# Altium schematic sheet MCU.SchDoc
size A4; SheetNumber: 1; SheetTotal: 1
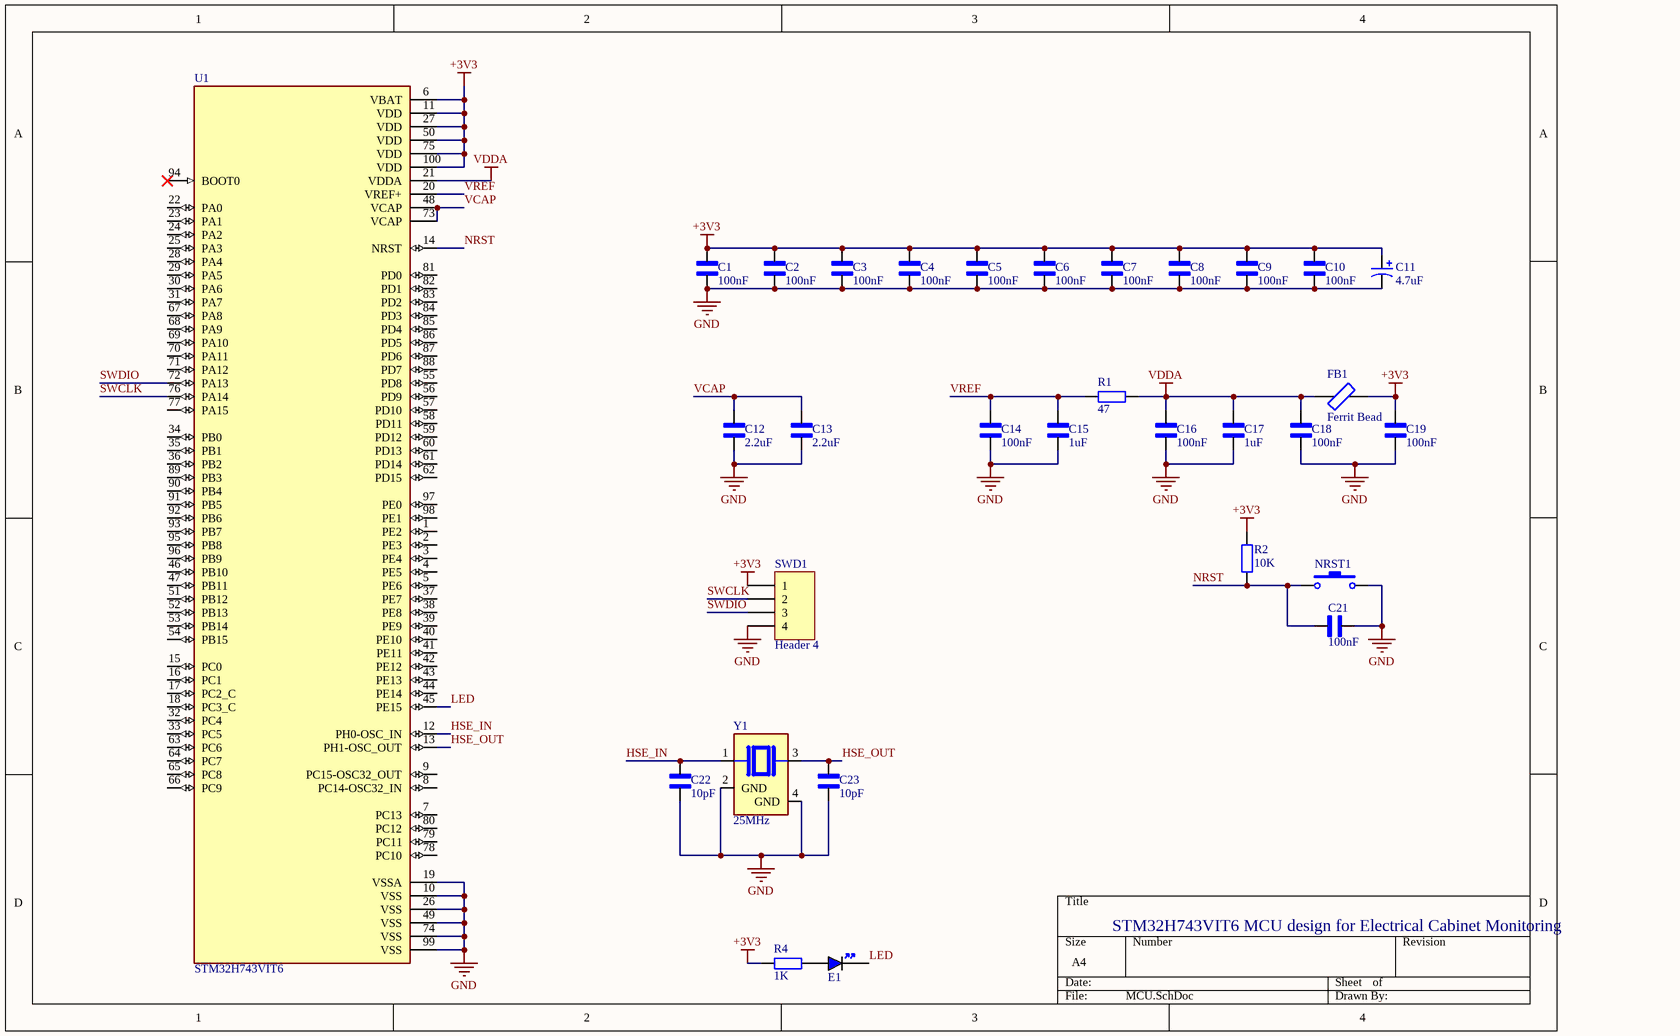
[diagram p0: MCU.SchDoc]

## Parts
C1  100nF  [CAPC2012X145N]
C2  100nF  [CAPC2012X145N]
C3  100nF  [CAPC2012X145N]
C4  100nF  [CAPC2012X145N]
C5  100nF  [CAPC2012X145N]
C6  100nF  [CAPC2012X145N]
C7  100nF  [CAPC2012X145N]
C8  100nF  [CAPC2012X145N]
C9  100nF  [CAPC2012X145N]
C10  100nF  [CAPC2012X145N]
C11  4.7uF  [CAPC2012X145N]
C12  2.2uF  [CAPC2012X145N]
C13  2.2uF  [CAPC2012X145N]
C14  100nF  [CAPC2012X145N]
C15  1uF  [CAPC2012X145N]
C16  100nF  [CAPC2012X145N]
C17  1uF  [CAPC2012X145N]
C18  100nF  [CAPC2012X145N]
C19  100nF  [CAPC2012X145N]
C21  100nF  [CAPC2012X145N]
C22  10pF  [CAPC2012X145N]
C23  10pF  [CAPC2012X145N]
E1  BLUE  [LED_0805_BLUE]  (value not drawn)
FB1  Ferrit Bead  [RES-SMD-0805]
NRST1  SW-SMD  [SW-SMD]  (value not drawn)
R1  47  [SM-0805]
R2  10K  [SM-0805]
R4  1K  [SM-0805]
SWD1  Header 4  [HDR1X4]
U1  STM32H743VIT6  [QFP50P1600X1600X160-100N]
Y1  25MHz  [XTAL_ABM8G-25.000MHZ-B4Y-T]

## Nets
+3V3: C1.2 C2.2 C3.2 C4.2 C5.2 C6.2 C7.2 C8.2 C9.2 C10.2 C11.2 C19.2 FB1.2 R2.2 R4.1 SWD1.1 U1.6(VBAT) U1.11(VDD) U1.27(VDD) U1.50(VDD) U1.75(VDD) U1.100(VDD)
GND: C1.1 C2.1 C3.1 C4.1 C5.1 C6.1 C7.1 C8.1 C9.1 C10.1 C11.1 C12.1 C13.1 C14.1 C15.1 C16.1 C17.1 C18.1 C19.1 C21.1 C22.1 C23.1 NRST1.2 SWD1.4 U1.10(VSS) U1.19(VSSA) U1.26(VSS) U1.49(VSS) U1.74(VSS) U1.99(VSS) Y1.2(GND) Y1.4(GND)
VDDA: C16.2 C17.2 C18.2 FB1.1 R1.2 U1.21(VDDA)
HSE_IN: C22.2 U1.12(PH0-OSC_IN) Y1.1
HSE_OUT: C23.2 U1.13(PH1-OSC_OUT) Y1.3
LED: E1.K U1.45(PE15)
NRST: C21.2 NRST1.1 R2.1 U1.14(NRST)
SWCLK: SWD1.2 U1.76(PA14)
SWDIO: SWD1.3 U1.72(PA13)
VCAP: C12.2 C13.2 U1.48(VCAP) U1.73(VCAP)
VREF: C14.2 C15.2 R1.1 U1.20(VREF+)
NetE1_A: E1.A R4.2

Not connected (* = marked no-connect by the designer): U1 1(PE2) 2(PE3) 3(PE4) 4(PE5) 5(PE6) 7(PC13) 8(PC14-OSC32_IN) 9(PC15-OSC32_OUT) 15(PC0) 16(PC1) 17(PC2_C) 18(PC3_C) 22(PA0) 23(PA1) 24(PA2) 25(PA3) 28(PA4) 29(PA5) 30(PA6) 31(PA7) 32(PC4) 33(PC5) 34(PB0) 35(PB1) 36(PB2) 37(PE7) 38(PE8) 39(PE9) 40(PE10) 41(PE11) 42(PE12) 43(PE13) 44(PE14) 46(PB10) 47(PB11) 51(PB12) 52(PB13) 53(PB14) 54(PB15) 55(PD8) 56(PD9) 57(PD10) 58(PD11) 59(PD12) 60(PD13) 61(PD14) 62(PD15) 63(PC6) 64(PC7) 65(PC8) 66(PC9) 67(PA8) 68(PA9) 69(PA10) 70(PA11) 71(PA12) 77(PA15) 78(PC10) 79(PC11) 80(PC12) 81(PD0) 82(PD1) 83(PD2) 84(PD3) 85(PD4) 86(PD5) 87(PD6) 88(PD7) 89(PB3) 90(PB4) 91(PB5) 92(PB6) 93(PB7) 94(BOOT0)* 95(PB8) 96(PB9) 97(PE0) 98(PE1)

## Notes on the sheet
- STM32H743VIT6 MCU design for Electrical Cabinet Monitoring

## Library data of the parts
C1-C10 C12-C19 C21-C23 = VJ0805A390GXCAP: 39 pF Â±2% 200V Ceramic Capacitor C0G, NP0 0805 (2012 Metric); MF: Vishay Vitramon; SnapEDA_Link: https://www.snapeda.com/parts/VJ0805A390GXCAP/Vishay/view-part/?ref=snap; Package: 2012 Vishay Vitramon; Value: *; MP: VJ0805A390GXCAP; Check_prices: https://www.snapeda.com/parts/VJ0805A390GXCAP/Vishay/view-part/?ref=eda
C11 = CAP_TAN_SMD: Polazied Tantalum Capacitor
E1 = LED_0805_BLUE: LED 0805 BLUE SMD; Manufacturer: *; Manufacturer Part Number: *; Distributor Link: *; LCSC: *
FB1 = Ferrit Bead: Generic Ferrit Bead
NRST1 = SW-SMD: Switch; Published: 24-Mar-1999; LatestRevisionDate: 17-Jul-2002; LatestRevisionNote: Re-released for DXP Platform.; PackageReference: SPST-2; Publisher: Altium Limited
R1 R2 = RM: Resistor SMD; Value: 1K
R4 = RM: Resistor SMD; Value: 1K
SWD1 = Header 4: Header, 4-Pin; LatestRevisionDate: 17-Jul-2002; LatestRevisionNote: Re-released for DXP Platform.; Publisher: Altium Limited
U1 = STM32H743VIT6: ARMÂ® CortexÂ®-M7 STM32H7 Microcontroller IC 32-Bit Single-Core 480MHz 2MB (2M x 8) FLASH 100-LQFP (14x14); MF: STMicroelectronics; SnapEDA_Link: https://www.snapeda.com/parts/STM32H743VIT6/STMicroelectronics/view-part/?ref=snap; Package: LQFP-100 STMicroelectronics; Value: *; MP: STM32H743VIT6; Check_prices: https://www.snapeda.com/parts/STM32H743VIT6/STMicroelectronics/view-part/?ref=eda
Y1 = ABM8G-25.000MHZ-B4Y-T: 25 MHz Â±30ppm Crystal 10pF 60 Ohms 4-SMD, No Lead; MF: Abracon; Value: *; SnapEDA_Link: https://www.snapeda.com/parts/ABM8G-25.000MHZ-B4Y-T/Abracon+LLC/view-part/?ref=snap; MP: ABM8G-25.000MHZ-B4Y-T; Check_prices: https://www.snapeda.com/parts/ABM8G-25.000MHZ-B4Y-T/Abracon+LLC/view-part/?ref=eda; Availability: In Stock; Price: None; Purchase-URL: https://pricing.snapeda.com/search/part/ABM8G-25.000MHZ-B4Y-T/?ref=eda; Package: SMD-4 Abracon